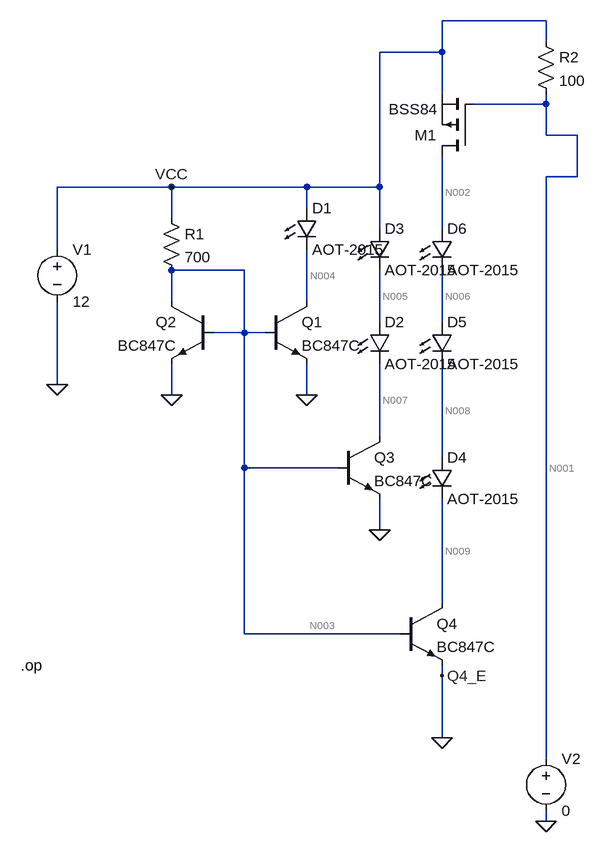
[diagram p0: schematic current_mirror.asc]
current_mirror.asc, the LTspice schematic file:
Version 4
SHEET 1 880 928
WIRE 640 -368 480 -368
WIRE 640 -336 640 -368
WIRE 480 -320 480 -368
WIRE 480 -320 384 -320
WIRE 480 -256 480 -320
WIRE 640 -240 640 -256
WIRE 640 -240 528 -240
WIRE 640 -192 640 -240
WIRE 688 -192 640 -192
WIRE 688 -128 688 -192
WIRE 688 -128 640 -128
WIRE 64 -112 -112 -112
WIRE 272 -112 64 -112
WIRE 384 -112 384 -320
WIRE 384 -112 272 -112
WIRE 272 -80 272 -112
WIRE 64 -64 64 -112
WIRE 384 -48 384 -112
WIRE 480 -48 480 -160
WIRE -112 -16 -112 -112
WIRE 176 16 64 16
WIRE 64 64 64 16
WIRE 272 64 272 -16
WIRE 384 96 384 16
WIRE 480 96 480 16
WIRE 176 112 176 16
WIRE 176 112 128 112
WIRE 208 112 176 112
WIRE -112 192 -112 64
WIRE 64 208 64 160
WIRE 272 208 272 160
WIRE 288 208 272 208
WIRE 384 272 384 160
WIRE 480 304 480 160
WIRE 176 320 176 112
WIRE 320 320 176 320
WIRE 384 416 384 368
WIRE 400 416 384 416
WIRE 480 528 480 368
WIRE 176 576 176 320
WIRE 416 576 176 576
WIRE 480 640 480 624
WIRE 480 736 480 640
WIRE 640 768 640 -128
WIRE 640 864 640 848
FLAG 64 208 0
FLAG 272 208 0
FLAG 64 -112 VCC
FLAG -112 192 0
FLAG 384 416 0
FLAG 480 736 0
FLAG 640 864 0
FLAG 480 640 Q4_E
SYMBOL npn 208 64 R0
SYMATTR InstName Q1
SYMATTR Value BC847C
SYMBOL npn 128 64 M0
SYMATTR InstName Q2
SYMATTR Value BC847C
SYMBOL res 48 -80 R0
SYMATTR InstName R1
SYMATTR Value 700
SYMBOL voltage -112 -32 R0
WINDOW 123 0 0 Left 2
WINDOW 39 0 0 Left 2
SYMATTR InstName V1
SYMATTR Value 12
SYMBOL npn 320 272 R0
SYMATTR InstName Q3
SYMATTR Value BC847C
SYMBOL npn 416 528 R0
SYMATTR InstName Q4
SYMATTR Value BC847C
SYMBOL LED 256 -80 R0
SYMATTR InstName D1
SYMATTR Value AOT-2015
SYMATTR Description Diode
SYMATTR Type diode
SYMBOL LED 368 96 R0
SYMATTR InstName D2
SYMATTR Value AOT-2015
SYMATTR Description Diode
SYMATTR Type diode
SYMBOL LED 368 -48 R0
SYMATTR InstName D3
SYMATTR Value AOT-2015
SYMATTR Description Diode
SYMATTR Type diode
SYMBOL LED 464 304 R0
SYMATTR InstName D4
SYMATTR Value AOT-2015
SYMATTR Description Diode
SYMATTR Type diode
SYMBOL LED 464 96 R0
SYMATTR InstName D5
SYMATTR Value AOT-2015
SYMATTR Description Diode
SYMATTR Type diode
SYMBOL LED 464 -48 R0
SYMATTR InstName D6
SYMATTR Value AOT-2015
SYMATTR Description Diode
SYMATTR Type diode
SYMBOL pmos 528 -160 R180
SYMATTR InstName M1
SYMATTR Value BSS84
SYMBOL voltage 640 752 R0
WINDOW 123 0 0 Left 2
WINDOW 39 0 0 Left 2
SYMATTR InstName V2
SYMATTR Value 0
SYMBOL res 624 -352 R0
SYMATTR InstName R2
SYMATTR Value 100
TEXT -168 624 Left 2 !.op

The netlist it stands for:
* current_mirror.asc
Q1 N004 N003 0 0 BC847C
Q2 N003 N003 0 0 BC847C
R1 VCC N003 700
V1 VCC 0 12
Q3 N007 N003 0 0 BC847C
Q4 N009 N003 0 0 BC847C
D1 VCC N004 AOT-2015
D2 N005 N007 AOT-2015
D3 VCC N005 AOT-2015
D4 N008 N009 AOT-2015
D5 N006 N008 AOT-2015
D6 N002 N006 AOT-2015
M1 N002 N001 VCC VCC BSS84
V2 N001 0 0
R2 VCC N001 100
.model D D
.lib standard.dio
.model NPN NPN
.model PNP PNP
.lib standard.bjt
.model NMOS NMOS
.model PMOS PMOS
.lib standard.mos
.op
.backanno
.end

* Results of the author's LTspice run, read from the files saved beside the schematic
* Operating Point:
*   V(n004) = 9.209 V
*   V(n003) = 715.4 mV
*   V(vcc) = 12 V
*   V(n007) = 6.431 V
*   V(n009) = 3.59 V
*   V(n005) = 9.216 V
*   V(n008) = 6.367 V
*   V(n006) = 9.144 V
*   V(n002) = 11.92 V
*   V(n001) = 0 V
*   Ic(Q4) = 16.68 mA
*   Ib(Q4) = 37.73 µA
*   Ie(Q4) = -16.72 mA
*   Ic(Q3) = 17.36 mA
*   Ib(Q3) = 37.09 µA
*   Ie(Q3) = -17.39 mA
*   Ic(Q2) = 15.97 mA
*   Ib(Q2) = 38.4 µA
*   Ie(Q2) = -16.01 mA
*   Ic(Q1) = 18.01 mA
*   Ib(Q1) = 36.49 µA
*   Ie(Q1) = -18.04 mA
*   Id(M1) = -16.68 mA
*   Ig(M1) = -40 pA
*   Is(M1) = 16.68 mA
*   I(D6) = 16.68 mA
*   I(D5) = 16.68 mA
*   I(D4) = 16.68 mA
*   I(D3) = 17.36 mA
*   I(D2) = 17.36 mA
*   I(D1) = 18.01 mA
*   I(R2) = 120 mA
*   I(R1) = 16.12 mA
*   I(V2) = 120 mA
*   I(V1) = -188.2 mA
* From the log:
*   Semiconductor Device Operating Points:
*                           --- Diodes ---
*   Name:      d6          d5          d4          d3          d2
*   Model:  aot-2015    aot-2015    aot-2015    aot-2015    aot-2015
*   Id:      1.67e-02    1.67e-02    1.67e-02    1.74e-02    1.74e-02
*   Vd:      2.78e+00    2.78e+00    2.78e+00    2.78e+00    2.78e+00
*   Req:     9.65e+00    9.65e+00    9.65e+00    9.27e+00    9.27e+00
*   CAP:     2.30e-09    2.30e-09    2.30e-09    2.31e-09    2.31e-09
*   Name:      d1
*   Model:  aot-2015
*   Id:      1.80e-02
*   Vd:      2.79e+00
*   Req:     8.94e+00
*   CAP:     2.31e-09
*                           --- Bipolar Transistors ---
*   Name:       q4          q3          q2          q1
*   Model:    bc847c      bc847c      bc847c      bc847c
*   Ib:       3.77e-05    3.71e-05    3.84e-05    3.65e-05
*   Ic:       1.67e-02    1.74e-02    1.60e-02    1.80e-02
*   Vbe:      7.15e-01    7.15e-01    7.15e-01    7.15e-01
*   Vbc:     -2.87e+00   -5.72e+00    0.00e+00   -8.49e+00
*   Vce:      3.59e+00    6.43e+00    7.15e-01    9.21e+00
*   BetaDC:   4.42e+02    4.68e+02    4.16e+02    4.93e+02
*   Gm:       5.61e-01    5.85e-01    5.37e-01    6.08e-01
*   Rpi:      6.83e+02    6.95e+02    6.71e+02    7.06e+02
*   Rx:       6.20e+00    6.21e+00    6.19e+00    6.22e+00
*   Ro:       3.02e+03    3.07e+03    2.98e+03    3.11e+03
*   Cbe:      2.99e-10    3.01e-10    2.99e-10    3.05e-10
*   Cbc:      1.01e-12    7.95e-13    2.11e-12    6.87e-13
*   Cjs:      0.00e+00    0.00e+00    0.00e+00    0.00e+00
*   BetaAC:   3.84e+02    4.07e+02    3.60e+02    4.30e+02
*   Cbx:      6.21e-13    4.89e-13    1.30e-12    4.22e-13
*   Ft:       2.97e+08    3.08e+08    2.82e+08    3.16e+08
*                           --- VDMOSFET Transistors ---
*   Name:          m1
*   Model:        bss84
*   Id:         -1.67e-02
*   Vgs:        -1.20e+01
*   Vds:        -7.85e-02
*   Vth:        -2.10e+00
*   Gm:          1.69e-03
*   Gds:         1.97e+00
*   Cgs:         2.00e-11
*   Cgd:         4.00e-11
*   Cbody:       9.63e-12